# EAGLE schematic TriDrone_mini_v1 (EAGLE 6.2)
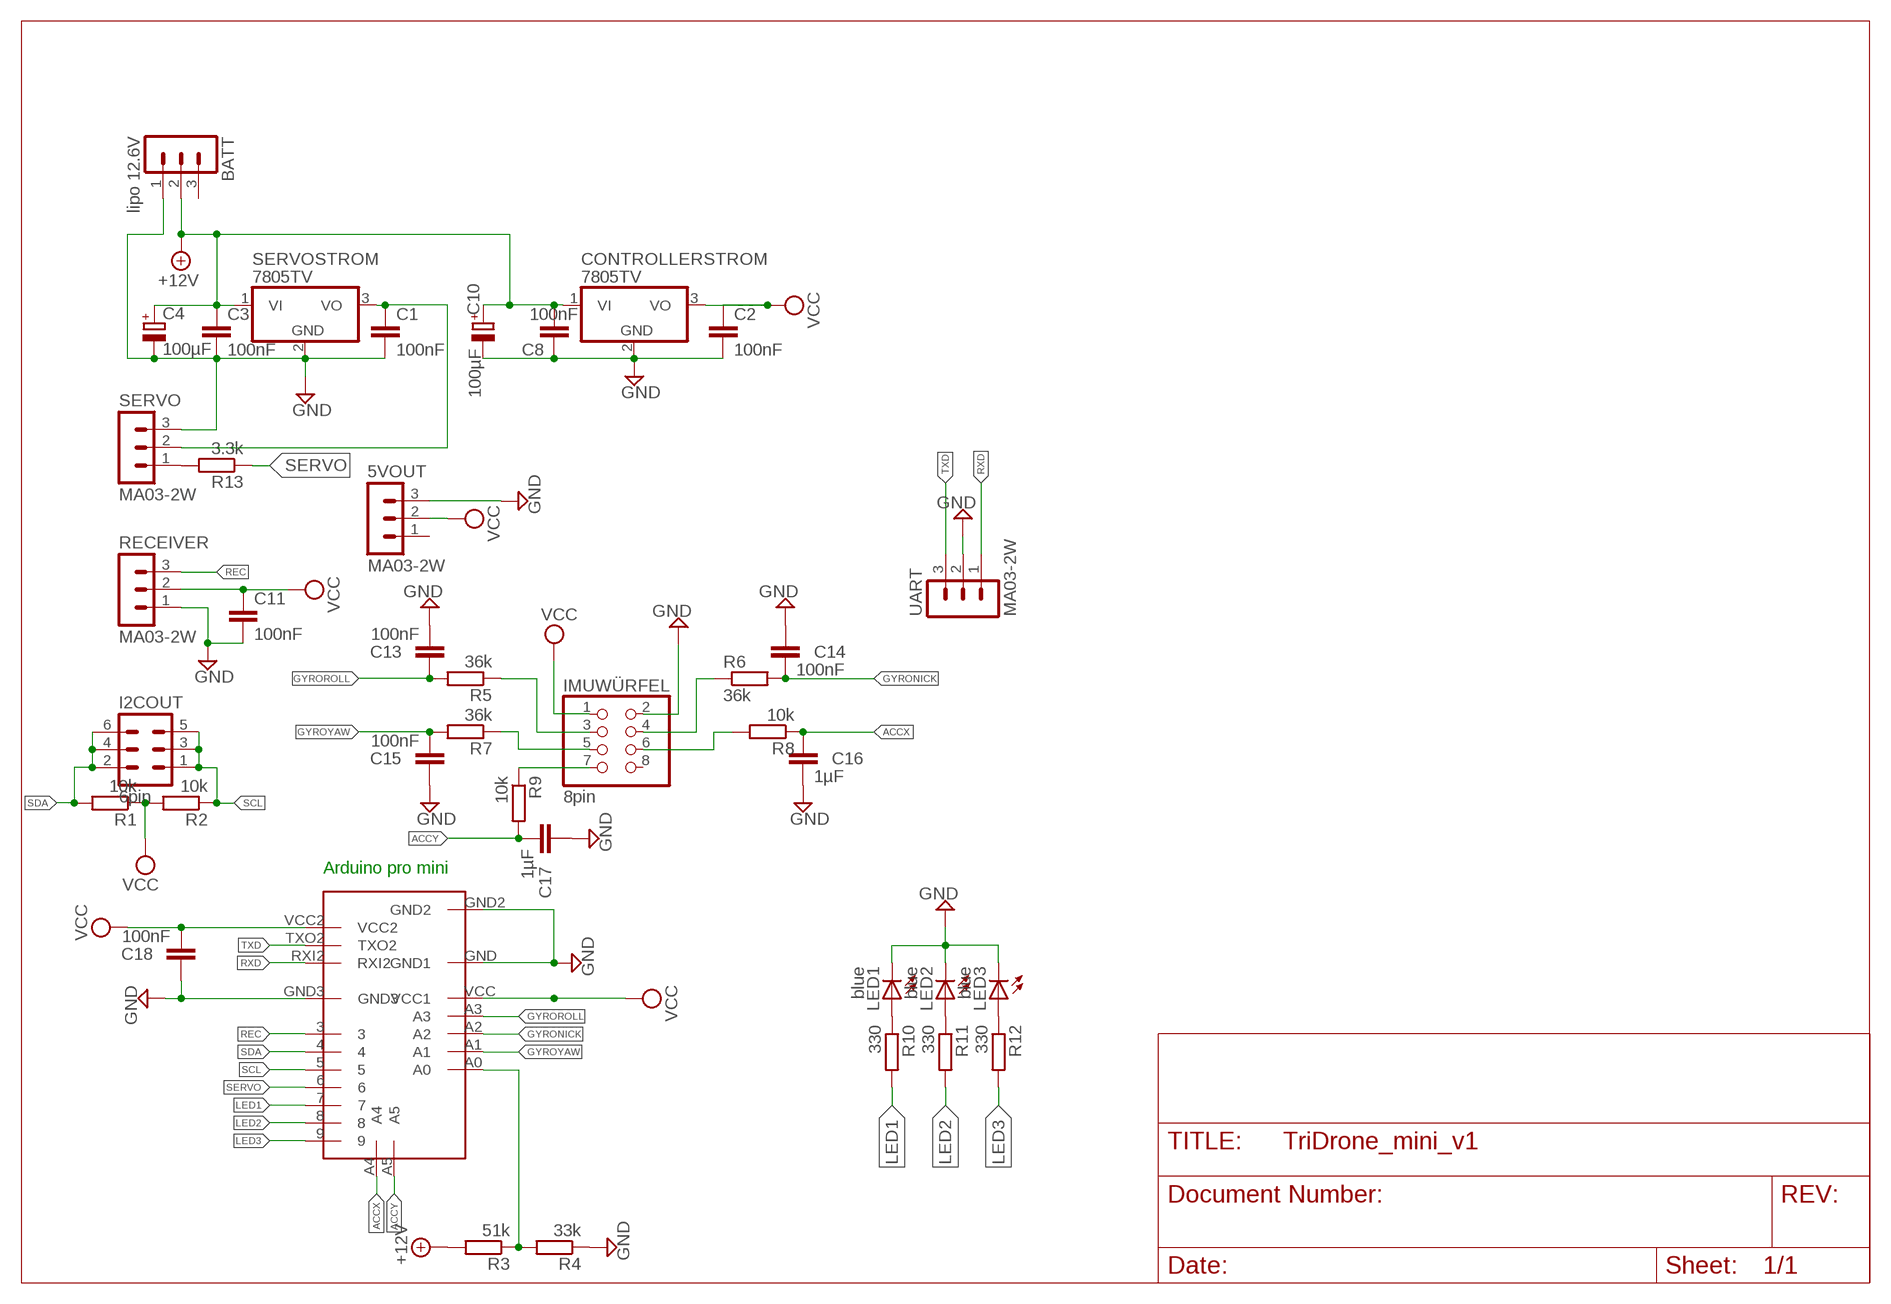
[diagram p0: schematic, sheet 1]

## Parts
5VOUT  MA03-2W  MA03-1  [MA03-1]
BATT  lipo 12.6V  MA03-1  [MA03-1]
C1  100nF  C-EUC1206  [C1206]
C2  100nF  C-EUC1206  [C1206]
C3  100nF  C-EUC1206  [C1206]
C4  100µF  CPOL-EUD/7343-31W  [D/7343-31W]
C8  100nF  C-EUC1206  [C1206]
C10  100µF  CPOL-EUD/7343-31W  [D/7343-31W]
C11  100nF  C-EUC1206  [C1206]
C13  100nF  C-EUC1206  [C1206]
C14  100nF  C-EUC1206  [C1206]
C15  100nF  C-EUC1206  [C1206]
C16  1µF  C-EUC1206  [C1206]
C17  1µF  C-EUC1206  [C1206]
C18  100nF  C-EUC1206  [C1206]
CONTROLLERSTROM  7805TV  [TO220V]
I2COUT  6pin  MA07-2W  [MA07-2W]
IMUWÜRFEL  8pin  PINHD-2X4  [2X04]
LED1  blue  LED3MM  [LED3MM]
LED2  blue  LED3MM  [LED3MM]
LED3  blue  LED3MM  [LED3MM]
R1  10k  R-EU_R1206  [R1206]
R2  10k  R-EU_R1206  [R1206]
R3  51k  R-EU_R1206  [R1206]
R4  33k  R-EU_R1206  [R1206]
R5  36k  R-EU_R1206  [R1206]
R6  36k  R-EU_R1206  [R1206]
R7  36k  R-EU_R1206  [R1206]
R8  10k  R-EU_R1206  [R1206]
R9  10k  R-EU_R1206  [R1206]
R10  330  R-EU_R1206  [R1206]
R11  330  R-EU_R1206  [R1206]
R12  330  R-EU_R1206  [R1206]
R13  3.3k  R-EU_R1206  [R1206]
RECEIVER  MA03-2W  MA03-1  [MA03-1]
SERVO  MA03-2W  MA03-1  [MA03-1]
SERVOSTROM  7805TV  [TO220V]
U$1  ARDUINOMINIPRO  [1X12]
UART  MA03-2W  MA03-1  [MA03-1]

## Nets
+12V: BATT.2 C3.1 C4.+ C8.2 C10.+ CONTROLLERSTROM.1(VI) R3.2 SERVOSTROM.1(VI)
ACCX: C16.1 R8.1 U$1.A4
ACCY: C17.2 R9.2 U$1.A5
GND: 5VOUT.3 BATT.1 C1.2 C2.2 C3.2 C4.- C8.1 C10.- C11.2 C13.2 C14.1 C15.1 C16.2 C17.1 C18.1 CONTROLLERSTROM.2(GND) IMUWÜRFEL.2 LED1.K(C) LED2.K(C) LED3.K(C) R4.1 RECEIVER.1 SERVO.3 SERVOSTROM.2(GND) U$1.GND2 U$1.GND3 U$1.GND(GND1) UART.2
GYRONICK: C14.2 R6.2 U$1.A2
GYROROLL: C13.1 R5.2 U$1.A3
GYROYAW: C15.2 R7.2 U$1.A1
LED1: R10.2 U$1.7
LED2: R11.2 U$1.8
LED3: R12.2 U$1.9
N$3: LED1.A R10.1
N$4: LED2.A R11.1
N$5: IMUWÜRFEL.3 R5.1
N$6: C1.1 SERVO.2 SERVOSTROM.3(VO)
N$7: LED3.A R12.1
N$9: R13.2 SERVO.1
N$10: R3.1 R4.2 U$1.A0
N$16: IMUWÜRFEL.4 R6.1
N$18: IMUWÜRFEL.5 R7.1
N$19: IMUWÜRFEL.6 R8.2
N$20: IMUWÜRFEL.7 R9.1
REC: RECEIVER.3 U$1.3
RXD: U$1.RXI2 UART.1
SCL: I2COUT.1 I2COUT.3 I2COUT.5 R2.1 U$1.5
SDA: I2COUT.2 I2COUT.4 I2COUT.6 R1.2 U$1.4
SERVO: R13.1 U$1.6
TXD: U$1.TXO2 UART.3
VCC: 5VOUT.2 C2.1 C11.1 C18.2 CONTROLLERSTROM.3(VO) IMUWÜRFEL.1 R1.1 R2.2 RECEIVER.2 U$1.VCC2 U$1.VCC(VCC1)
Unconnected: 5VOUT.1 BATT.3 IMUWÜRFEL.8

## Notes on the sheet
- Arduino pro mini

## Library data of the parts
5VOUT BATT RECEIVER SERVO UART = con-lstb:MA03-1: PIN HEADER
C1-C3 C8 C11 C13-C18 = rcl:C-EU: CAPACITOR, European symbol
C4 C10 = rcl:CPOL-EU: POLARIZED CAPACITOR, European symbol
CONTROLLERSTROM SERVOSTROM = linear:78*: Positive VOLTAGE REGULATOR Source: http://cache.national.com/ds/LM/LM78L05.pdf http://www.fairchildsemi.com/ds/LM/LM7805.pdf
I2COUT = TricopterSpecial:MA07-2W: PIN HEADER
IMUWÜRFEL = TricopterSpecial:PINHD-2X4: PIN HEADER
LED1-LED3 = Tricopter3:LED: LED OSRAM: - CHIPLED LG R971, LG N971, LY N971, LG Q971, LY Q971, LO R971, LY R971 LH N974, LH R974 LS Q976, LO Q976, LY Q976 LO Q996 - Hyper CHIPLED LW Q18S LB Q993, LB Q99A, LB R99A - SideLED LS A670, LO A670, LY A670, LG A670, LP A670 LB A673, LV A673, LT A673, LW A673 LH A674 LY A675 LS A676, LA A676, LO A676, LY A676, LW A676 LS A679, LY A679, LG A679 - Hyper Micro SIDELED® LS Y876, LA Y876, LO Y876, LY Y876 LT Y87S - SmartLED LW L88C, LW L88S LB L89C, LB L89S, LG L890 LS L89K, LO L89K, LY L89K LS L896, LA L896, LO L896, LY L896 - TOPLED LS T670, LO T670, LY T670, LG T670, LP T670 LSG T670, LSP T670, LSY T670, LOP T670, LYG T670 LG T671, LOG T671, LSG T671 LB T673, LV T673, LT T673, LW T673 LH T674 LS T676, LA T676, LO T676, LY T676, LB T676, LH T676, LSB T676, LW T676 LB T67C, LV T67C, LT T67C, LS T67K, LO T67K, LY T67K, LW E67C LS E67B, LA E67B, LO E67B, LY E67B, LB E67C, LV E67C, LT E67C LW T67C LS T679, LY T679, LG T679 LS T770, LO T770, LY T770, LG T770, LP T770 LB T773, LV T773, LT T773, LW T773 LH T774 LS E675, LA E675, LY E675, LS T675 LS T776, LA T776, LO T776, LY T776, LB T776 LHGB T686 LT T68C, LB T68C - Hyper Mini TOPLED® LB M676 - Mini TOPLED Santana® LG M470 LS M47K, LO M47K, LY M47K Source: http://www.osram.convergy.de LUXEON: - LUMILED® LXK2-PW12-R00, LXK2-PW12-S00, LXK2-PW14-U00, LXK2-PW14-V00 LXK2-PM12-R00, LXK2-PM12-S00, LXK2-PM14-U00 LXK2-PE12-Q00, LXK2-PE12-R00, LXK2-PE12-S00, LXK2-PE14-T00, LXK2-PE14-U00 LXK2-PB12-K00, LXK2-PB12-L00, LXK2-PB12-M00, LXK2-PB14-N00, LXK2-PB14-P00, LXK2-PB14-Q00 LXK2-PR12-L00, LXK2-PR12-M00, LXK2-PR14-Q00, LXK2-PR14-R00 LXK2-PD12-Q00, LXK2-PD12-R00, LXK2-PD12-S00 LXK2-PH12-R00, LXK2-PH12-S00 LXK2-PL12-P00, LXK2-PL12-Q00, LXK2-PL12-R00 Source: www.luxeon.com KINGBRIGHT: KA-3528ASYC Source: www.kingbright.com
R1-R13 = resistor:R-EU_: RESISTOR, European symbol
U$1 = TricopterSpecial2:ARDUINOMINIPRO